# Altium project MiniPC MB GOST.PrjPcb (part 22 of 31)
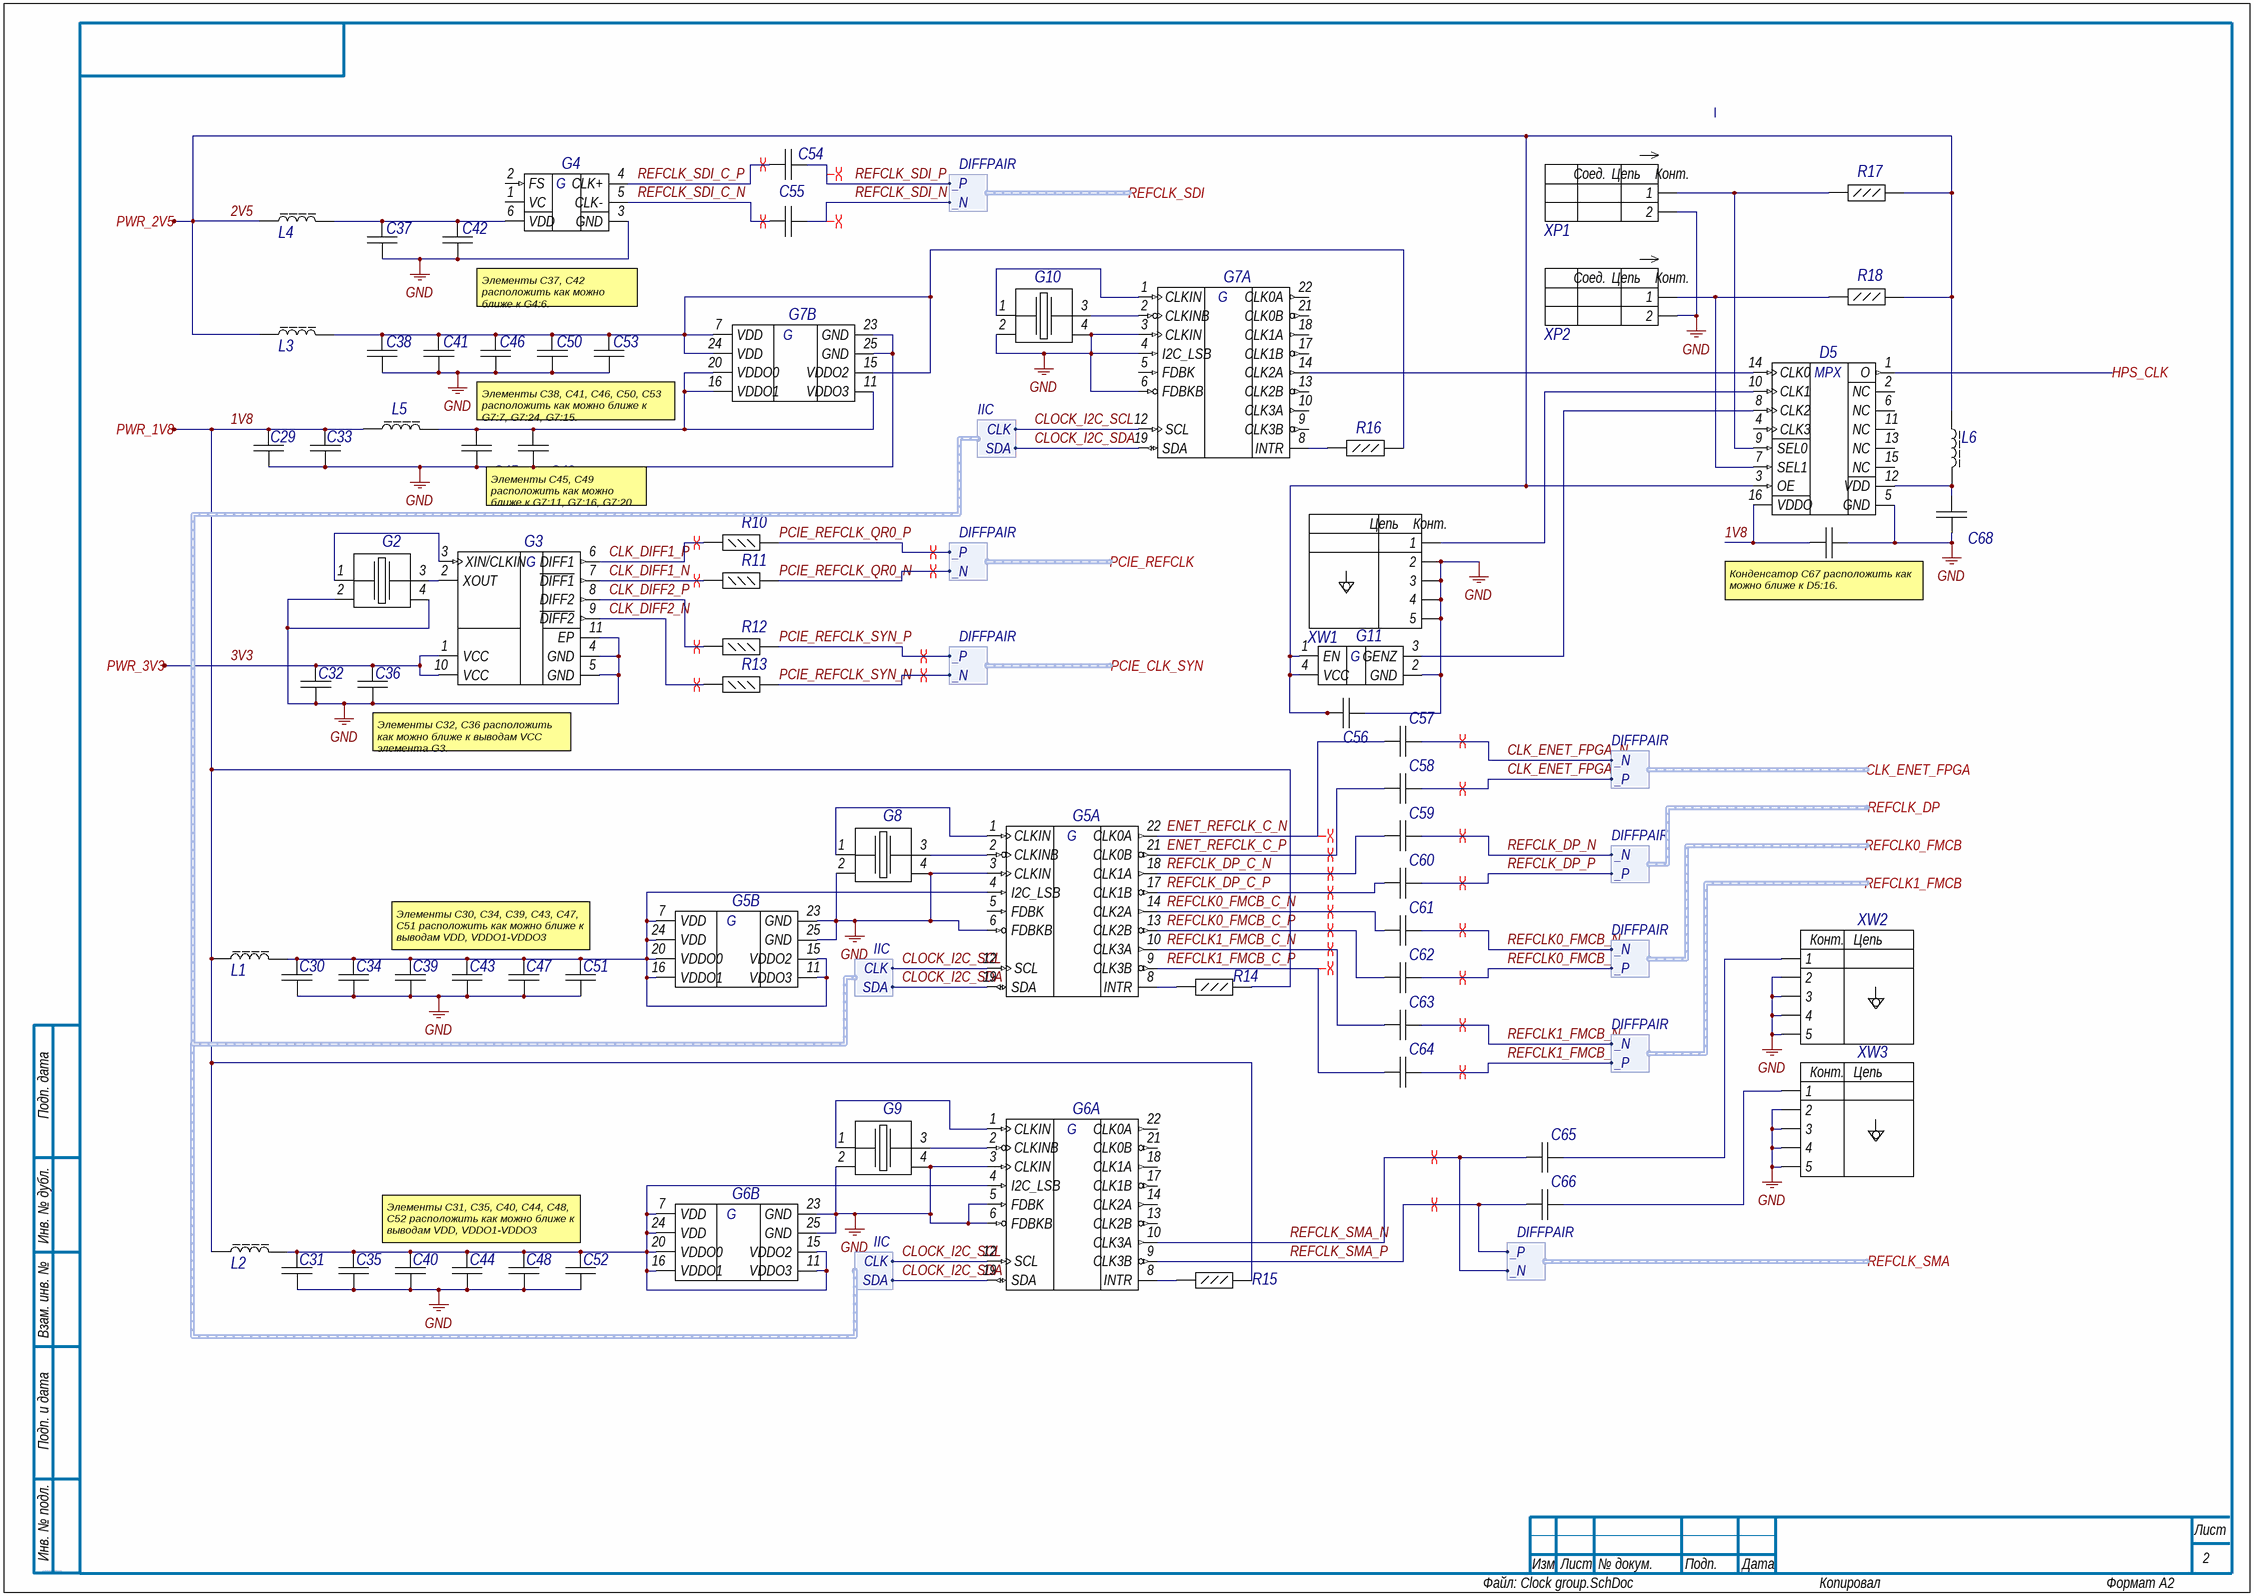
[diagram p50: Clock group.SchDoc]

## Sheet Clock group.SchDoc (continued)

### Library data of the parts (continued)
L5 = E48: SMD EMI Suppression Ferrite Bead WE-CBF, Z = 220 Ohm; Тип элемента: Ферритовый дроссель; Impedance: 220 Ohm; Old_des: L20; New_des: L5; UID: E48; Component Kind: Standard; ComponentLink1Description: Manufacturer Link; ComponentLink1URL: http://www.we-online.com; ComponentLink2Description: Datasheet; ComponentLink2URL: http://www.we-online.de/katalog/media/pdf/742792780.pdf; DatasheetVersion: ver 4, Jul-2009; PackageDescription: Chip Inductor, 2-Leads, Body 1.0 x 0.5 mm; PackageReference: SMD-0402; PackageVersion: 2009
L6 = E48: SMD EMI Suppression Ferrite Bead WE-CBF, Z = 220 Ohm; Тип элемента: Ферритовый дроссель; Impedance: 220 Ohm; Old_des: L21; New_des: L6; UID: E48; Component Kind: Standard; ComponentLink1Description: Manufacturer Link; ComponentLink1URL: http://www.we-online.com; ComponentLink2Description: Datasheet; ComponentLink2URL: http://www.we-online.de/katalog/media/pdf/742792780.pdf; DatasheetVersion: ver 4, Jul-2009; PackageDescription: Chip Inductor, 2-Leads, Body 1.0 x 0.5 mm; PackageReference: SMD-0402; PackageVersion: 2009
R10 = E64: Chip Resistor, 0 mOhm, +/- 5%, 100 mW, -55 to 155 degC, 0402 (1005 Metric), RoHS, Tape and Reel; Manufacturer: Basic Passives; Тип элемента: Резистор; Case\/Package: 0402; Voltage Rating: 50 V; Power Rating: 100 mW; Resistance: 0 mOhm; Old_des: R335; New_des: R10; UID: E64; Component Kind: Standard; Case Code (Imperial): 0402; Case Code (Metric): 1005; ComponentLink1Description: Manufacturer URL; ComponentLink1URL: http://www.panasonic.com/; ComponentLink2Description: Datasheet; ComponentLink2URL: http://industrial.panasonic.com/cdbs/www-data/pdf/RDA0000/AOA0000C84.pdf; DatasheetVersion: 03/2015; Length: 1 mm; Max Operating Temperature: 155 degC; Min Operating Temperature: -55 degC; Mounting Technology: Surface Mount; Package Quantity: 10000; PackageDescription: 2-Pin Surface Mount Device, Body 1 x 0.5 mm; Packaging: Tape and Reel; PartNumber: ERJ-2GE0R00X; RoHSCompliant: true; Tolerance: 5%; Width: 0.5 mm; Height: 0.35 mm; Mount: Surface Mount; PackageReference: 0402; Pins: 2; Radiation Hardening: No; REACH SVHC: Unknown
R11 = E64: Chip Resistor, 0 mOhm, +/- 5%, 100 mW, -55 to 155 degC, 0402 (1005 Metric), RoHS, Tape and Reel; Manufacturer: Basic Passives; Тип элемента: Резистор; Case\/Package: 0402; Voltage Rating: 50 V; Power Rating: 100 mW; Resistance: 0 mOhm; Old_des: R336; New_des: R11; UID: E64; Component Kind: Standard; Case Code (Imperial): 0402; Case Code (Metric): 1005; ComponentLink1Description: Manufacturer URL; ComponentLink1URL: http://www.panasonic.com/; ComponentLink2Description: Datasheet; ComponentLink2URL: http://industrial.panasonic.com/cdbs/www-data/pdf/RDA0000/AOA0000C84.pdf; DatasheetVersion: 03/2015; Length: 1 mm; Max Operating Temperature: 155 degC; Min Operating Temperature: -55 degC; Mounting Technology: Surface Mount; Package Quantity: 10000; PackageDescription: 2-Pin Surface Mount Device, Body 1 x 0.5 mm; Packaging: Tape and Reel; PartNumber: ERJ-2GE0R00X; RoHSCompliant: true; Tolerance: 5%; Width: 0.5 mm; Height: 0.35 mm; Mount: Surface Mount; PackageReference: 0402; Pins: 2; Radiation Hardening: No; REACH SVHC: Unknown
R12 = E64: Chip Resistor, 0 mOhm, +/- 5%, 100 mW, -55 to 155 degC, 0402 (1005 Metric), RoHS, Tape and Reel; Manufacturer: Basic Passives; Тип элемента: Резистор; Case\/Package: 0402; Voltage Rating: 50 V; Power Rating: 100 mW; Resistance: 0 mOhm; Old_des: R337; New_des: R12; UID: E64; Component Kind: Standard; Case Code (Imperial): 0402; Case Code (Metric): 1005; ComponentLink1Description: Manufacturer URL; ComponentLink1URL: http://www.panasonic.com/; ComponentLink2Description: Datasheet; ComponentLink2URL: http://industrial.panasonic.com/cdbs/www-data/pdf/RDA0000/AOA0000C84.pdf; DatasheetVersion: 03/2015; Length: 1 mm; Max Operating Temperature: 155 degC; Min Operating Temperature: -55 degC; Mounting Technology: Surface Mount; Package Quantity: 10000; PackageDescription: 2-Pin Surface Mount Device, Body 1 x 0.5 mm; Packaging: Tape and Reel; PartNumber: ERJ-2GE0R00X; RoHSCompliant: true; Tolerance: 5%; Width: 0.5 mm; Height: 0.35 mm; Mount: Surface Mount; PackageReference: 0402; Pins: 2; Radiation Hardening: No; REACH SVHC: Unknown
R13 = E64: Chip Resistor, 0 mOhm, +/- 5%, 100 mW, -55 to 155 degC, 0402 (1005 Metric), RoHS, Tape and Reel; Manufacturer: Basic Passives; Тип элемента: Резистор; Case\/Package: 0402; Voltage Rating: 50 V; Power Rating: 100 mW; Resistance: 0 mOhm; Old_des: R338; New_des: R13; UID: E64; Component Kind: Standard; Case Code (Imperial): 0402; Case Code (Metric): 1005; ComponentLink1Description: Manufacturer URL; ComponentLink1URL: http://www.panasonic.com/; ComponentLink2Description: Datasheet; ComponentLink2URL: http://industrial.panasonic.com/cdbs/www-data/pdf/RDA0000/AOA0000C84.pdf; DatasheetVersion: 03/2015; Length: 1 mm; Max Operating Temperature: 155 degC; Min Operating Temperature: -55 degC; Mounting Technology: Surface Mount; Package Quantity: 10000; PackageDescription: 2-Pin Surface Mount Device, Body 1 x 0.5 mm; Packaging: Tape and Reel; PartNumber: ERJ-2GE0R00X; RoHSCompliant: true; Tolerance: 5%; Width: 0.5 mm; Height: 0.35 mm; Mount: Surface Mount; PackageReference: 0402; Pins: 2; Radiation Hardening: No; REACH SVHC: Unknown
R14 = E99: Chip Resistor, 4.7 KOhm, +/- 1%, 0.1 W, -55 to 155 degC, 0402 (1005 Metric), RoHS, Tape and Reel; Тип элемента: Резистор; Case\/Package: 0402; Voltage Rating: 50 V; Power Rating: 100 mW; Old_des: R333; New_des: R14; UID: E99; Component Kind: Standard; Case Code (Imperial): 0402; Case Code (Metric): 1005; ComponentLink1Description: Manufacturer URL; ComponentLink1URL: http://www.panasonic.com/; ComponentLink2Description: Datasheet; ComponentLink2URL: http://industrial.panasonic.com/cdbs/www-data/pdf/RDA0000/AOA0000C86.pdf; DatasheetVersion: 04/2015; Length: 1 mm; Max Operating Temperature: 155 degC; Min Operating Temperature: -55 degC; Mounting Technology: Surface Mount; Package Quantity: 1; PackageDescription: 2-Pin Surface Mount Device, Body 1 x 0.5 mm; Packaging: Cut Tape; PartNumber: ERJ-2RKF4701X; RoHSCompliant: true; Tolerance: 1%; Width: 0.5 mm; Height: 0.35 mm; Mount: Surface Mount; PackageReference: 0402; Pins: 2; Radiation Hardening: No; REACH SVHC: Yes; Resistance: 4.7 KOhm
R15 = E99: Chip Resistor, 4.7 KOhm, +/- 1%, 0.1 W, -55 to 155 degC, 0402 (1005 Metric), RoHS, Tape and Reel; Тип элемента: Резистор; Case\/Package: 0402; Voltage Rating: 50 V; Power Rating: 100 mW; Old_des: R334; New_des: R15; UID: E99; Component Kind: Standard; Case Code (Imperial): 0402; Case Code (Metric): 1005; ComponentLink1Description: Manufacturer URL; ComponentLink1URL: http://www.panasonic.com/; ComponentLink2Description: Datasheet; ComponentLink2URL: http://industrial.panasonic.com/cdbs/www-data/pdf/RDA0000/AOA0000C86.pdf; DatasheetVersion: 04/2015; Length: 1 mm; Max Operating Temperature: 155 degC; Min Operating Temperature: -55 degC; Mounting Technology: Surface Mount; Package Quantity: 1; PackageDescription: 2-Pin Surface Mount Device, Body 1 x 0.5 mm; Packaging: Cut Tape; PartNumber: ERJ-2RKF4701X; RoHSCompliant: true; Tolerance: 1%; Width: 0.5 mm; Height: 0.35 mm; Mount: Surface Mount; PackageReference: 0402; Pins: 2; Radiation Hardening: No; REACH SVHC: Yes; Resistance: 4.7 KOhm
R16 = E59: Chip Resistor, 1 KOhm, +/- 1%, 100 mW, -55 to 155 degC, 0402 (1005 Metric), RoHS, Tape and Reel; Manufacturer: Basic Passives; Тип элемента: Резистор; Case\/Package: 0402; Voltage Rating: 50 V; Power Rating: 100 mW; Resistance: 1 KOhm; Old_des: R339; New_des: R16; UID: E59; Component Kind: Standard; Case Code (Imperial): 0402; Case Code (Metric): 1005; ComponentLink1Description: Manufacturer URL; ComponentLink1URL: http://www.panasonic.com/; ComponentLink2Description: Datasheet; ComponentLink2URL: http://industrial.panasonic.com/cdbs/www-data/pdf/RDA0000/AOA0000C86.pdf; DatasheetVersion: 04/2015; Length: 1 mm; Max Operating Temperature: 155 degC; Min Operating Temperature: -55 degC; Mounting Technology: Surface Mount; Package Quantity: 10000; PackageDescription: 2-Pin Surface Mount Device, Body 1 x 0.5 mm; Packaging: Tape and Reel; PartNumber: ERJ-2RKF1001X; RoHSCompliant: true; Tolerance: 1%; Width: 0.5 mm; Height: 0.35 mm; Mount: Surface Mount; PackageReference: 0402; Pins: 2; Radiation Hardening: No; REACH SVHC: Yes
R17 = E59: Chip Resistor, 1 KOhm, +/- 1%, 100 mW, -55 to 155 degC, 0402 (1005 Metric), RoHS, Tape and Reel; Manufacturer: Basic Passives; Тип элемента: Резистор; Case\/Package: 0402; Voltage Rating: 50 V; Power Rating: 100 mW; Resistance: 1 KOhm; Old_des: R340; New_des: R17; UID: E59; Component Kind: Standard; Case Code (Imperial): 0402; Case Code (Metric): 1005; ComponentLink1Description: Manufacturer URL; ComponentLink1URL: http://www.panasonic.com/; ComponentLink2Description: Datasheet; ComponentLink2URL: http://industrial.panasonic.com/cdbs/www-data/pdf/RDA0000/AOA0000C86.pdf; DatasheetVersion: 04/2015; Length: 1 mm; Max Operating Temperature: 155 degC; Min Operating Temperature: -55 degC; Mounting Technology: Surface Mount; Package Quantity: 10000; PackageDescription: 2-Pin Surface Mount Device, Body 1 x 0.5 mm; Packaging: Tape and Reel; PartNumber: ERJ-2RKF1001X; RoHSCompliant: true; Tolerance: 1%; Width: 0.5 mm; Height: 0.35 mm; Mount: Surface Mount; PackageReference: 0402; Pins: 2; Radiation Hardening: No; REACH SVHC: Yes
R18 = E59: Chip Resistor, 1 KOhm, +/- 1%, 100 mW, -55 to 155 degC, 0402 (1005 Metric), RoHS, Tape and Reel; Manufacturer: Basic Passives; Тип элемента: Резистор; Case\/Package: 0402; Voltage Rating: 50 V; Power Rating: 100 mW; Resistance: 1 KOhm; Old_des: R341; New_des: R18; UID: E59; Component Kind: Standard; Case Code (Imperial): 0402; Case Code (Metric): 1005; ComponentLink1Description: Manufacturer URL; ComponentLink1URL: http://www.panasonic.com/; ComponentLink2Description: Datasheet; ComponentLink2URL: http://industrial.panasonic.com/cdbs/www-data/pdf/RDA0000/AOA0000C86.pdf; DatasheetVersion: 04/2015; Length: 1 mm; Max Operating Temperature: 155 degC; Min Operating Temperature: -55 degC; Mounting Technology: Surface Mount; Package Quantity: 10000; PackageDescription: 2-Pin Surface Mount Device, Body 1 x 0.5 mm; Packaging: Tape and Reel; PartNumber: ERJ-2RKF1001X; RoHSCompliant: true; Tolerance: 1%; Width: 0.5 mm; Height: 0.35 mm; Mount: Surface Mount; PackageReference: 0402; Pins: 2; Radiation Hardening: No; REACH SVHC: Yes
XP1 = E32: Male Header, Pitch 2.54 mm, 1 x 2 Position, Height 8.54 mm, Tail Length 3 mm, -40 to 105 degC, RoHS, Bulk; Manufacturer: Wuerth Elektronik; Тип элемента: Соединитель; Old_des: J18; New_des: XP1; UID: E32; Component Kind: Standard; ComponentLink1Description: Manufacturer URL; ComponentLink1URL: https://www.we-online.com/; ComponentLink2Description: Datasheet; ComponentLink2URL: http://katalog.we-online.de/em/datasheet/6130xx11121.pdf; DatasheetVersion: Rev. J; Mounting Technology: Through Hole; PackageDescription: Male Header, Pitch 2.54 mm, 1 x 2 Position, Height 8.54 mm, Tail Length 3 mm; PartNumber: 613 002 111 21; PackageReference: 61300211121
XP2 = E32: Male Header, Pitch 2.54 mm, 1 x 2 Position, Height 8.54 mm, Tail Length 3 mm, -40 to 105 degC, RoHS, Bulk; Manufacturer: Wuerth Elektronik; Тип элемента: Соединитель; Old_des: J19; New_des: XP2; UID: E32; Component Kind: Standard; ComponentLink1Description: Manufacturer URL; ComponentLink1URL: https://www.we-online.com/; ComponentLink2Description: Datasheet; ComponentLink2URL: http://katalog.we-online.de/em/datasheet/6130xx11121.pdf; DatasheetVersion: Rev. J; Mounting Technology: Through Hole; PackageDescription: Male Header, Pitch 2.54 mm, 1 x 2 Position, Height 8.54 mm, Tail Length 3 mm; PartNumber: 613 002 111 21; PackageReference: 61300211121
XW1 = E42: SMA Connector, Pitch 2.54 mm, 1 Position, Height 9.5 mm, Tail Length 4 mm, RoHS; Manufacturer: Lighthorse Technologies Inc.; Тип элемента: Соединитель ВЧ; Old_des: J17; New_des: XW1; UID: E42; Component Kind: Standard; ComponentLink1Description: Manufacturer URL; ComponentLink1URL: http://www.rfconnector.com; ComponentLink2Description: Datasheet; ComponentLink2URL: http://rfconnector.com/sheets/SASF54GT.pdf; DatasheetVersion: Rev. May-99; Mounting Technology: Through Hole; PackageDescription: SMA Connector, Pitch 2.54 mm, 1 Position, Height 9.5 mm, Tail Length 4 mm; PartNumber: LTI-SASF54GT; PackageReference: LTI-SASF54GT
XW2 = E42: SMA Connector, Pitch 2.54 mm, 1 Position, Height 9.5 mm, Tail Length 4 mm, RoHS; Manufacturer: Lighthorse Technologies Inc.; Тип элемента: Соединитель ВЧ; Old_des: J15; New_des: XW2; UID: E42; Component Kind: Standard; ComponentLink1Description: Manufacturer URL; ComponentLink1URL: http://www.rfconnector.com; ComponentLink2Description: Datasheet; ComponentLink2URL: http://rfconnector.com/sheets/SASF54GT.pdf; DatasheetVersion: Rev. May-99; Mounting Technology: Through Hole; PackageDescription: SMA Connector, Pitch 2.54 mm, 1 Position, Height 9.5 mm, Tail Length 4 mm; PartNumber: LTI-SASF54GT; PackageReference: LTI-SASF54GT
XW3 = E42: SMA Connector, Pitch 2.54 mm, 1 Position, Height 9.5 mm, Tail Length 4 mm, RoHS; Manufacturer: Lighthorse Technologies Inc.; Тип элемента: Соединитель ВЧ; Old_des: J16; New_des: XW3; UID: E42; Component Kind: Standard; ComponentLink1Description: Manufacturer URL; ComponentLink1URL: http://www.rfconnector.com; ComponentLink2Description: Datasheet; ComponentLink2URL: http://rfconnector.com/sheets/SASF54GT.pdf; DatasheetVersion: Rev. May-99; Mounting Technology: Through Hole; PackageDescription: SMA Connector, Pitch 2.54 mm, 1 Position, Height 9.5 mm, Tail Length 4 mm; PartNumber: LTI-SASF54GT; PackageReference: LTI-SASF54GT

## Sheet Display Port Interface.SchDoc
size 420 x 297 mm; Author: ALTIUM GOSTBOM2.0 KEV; SheetNumber: 3; SheetTotal: 48
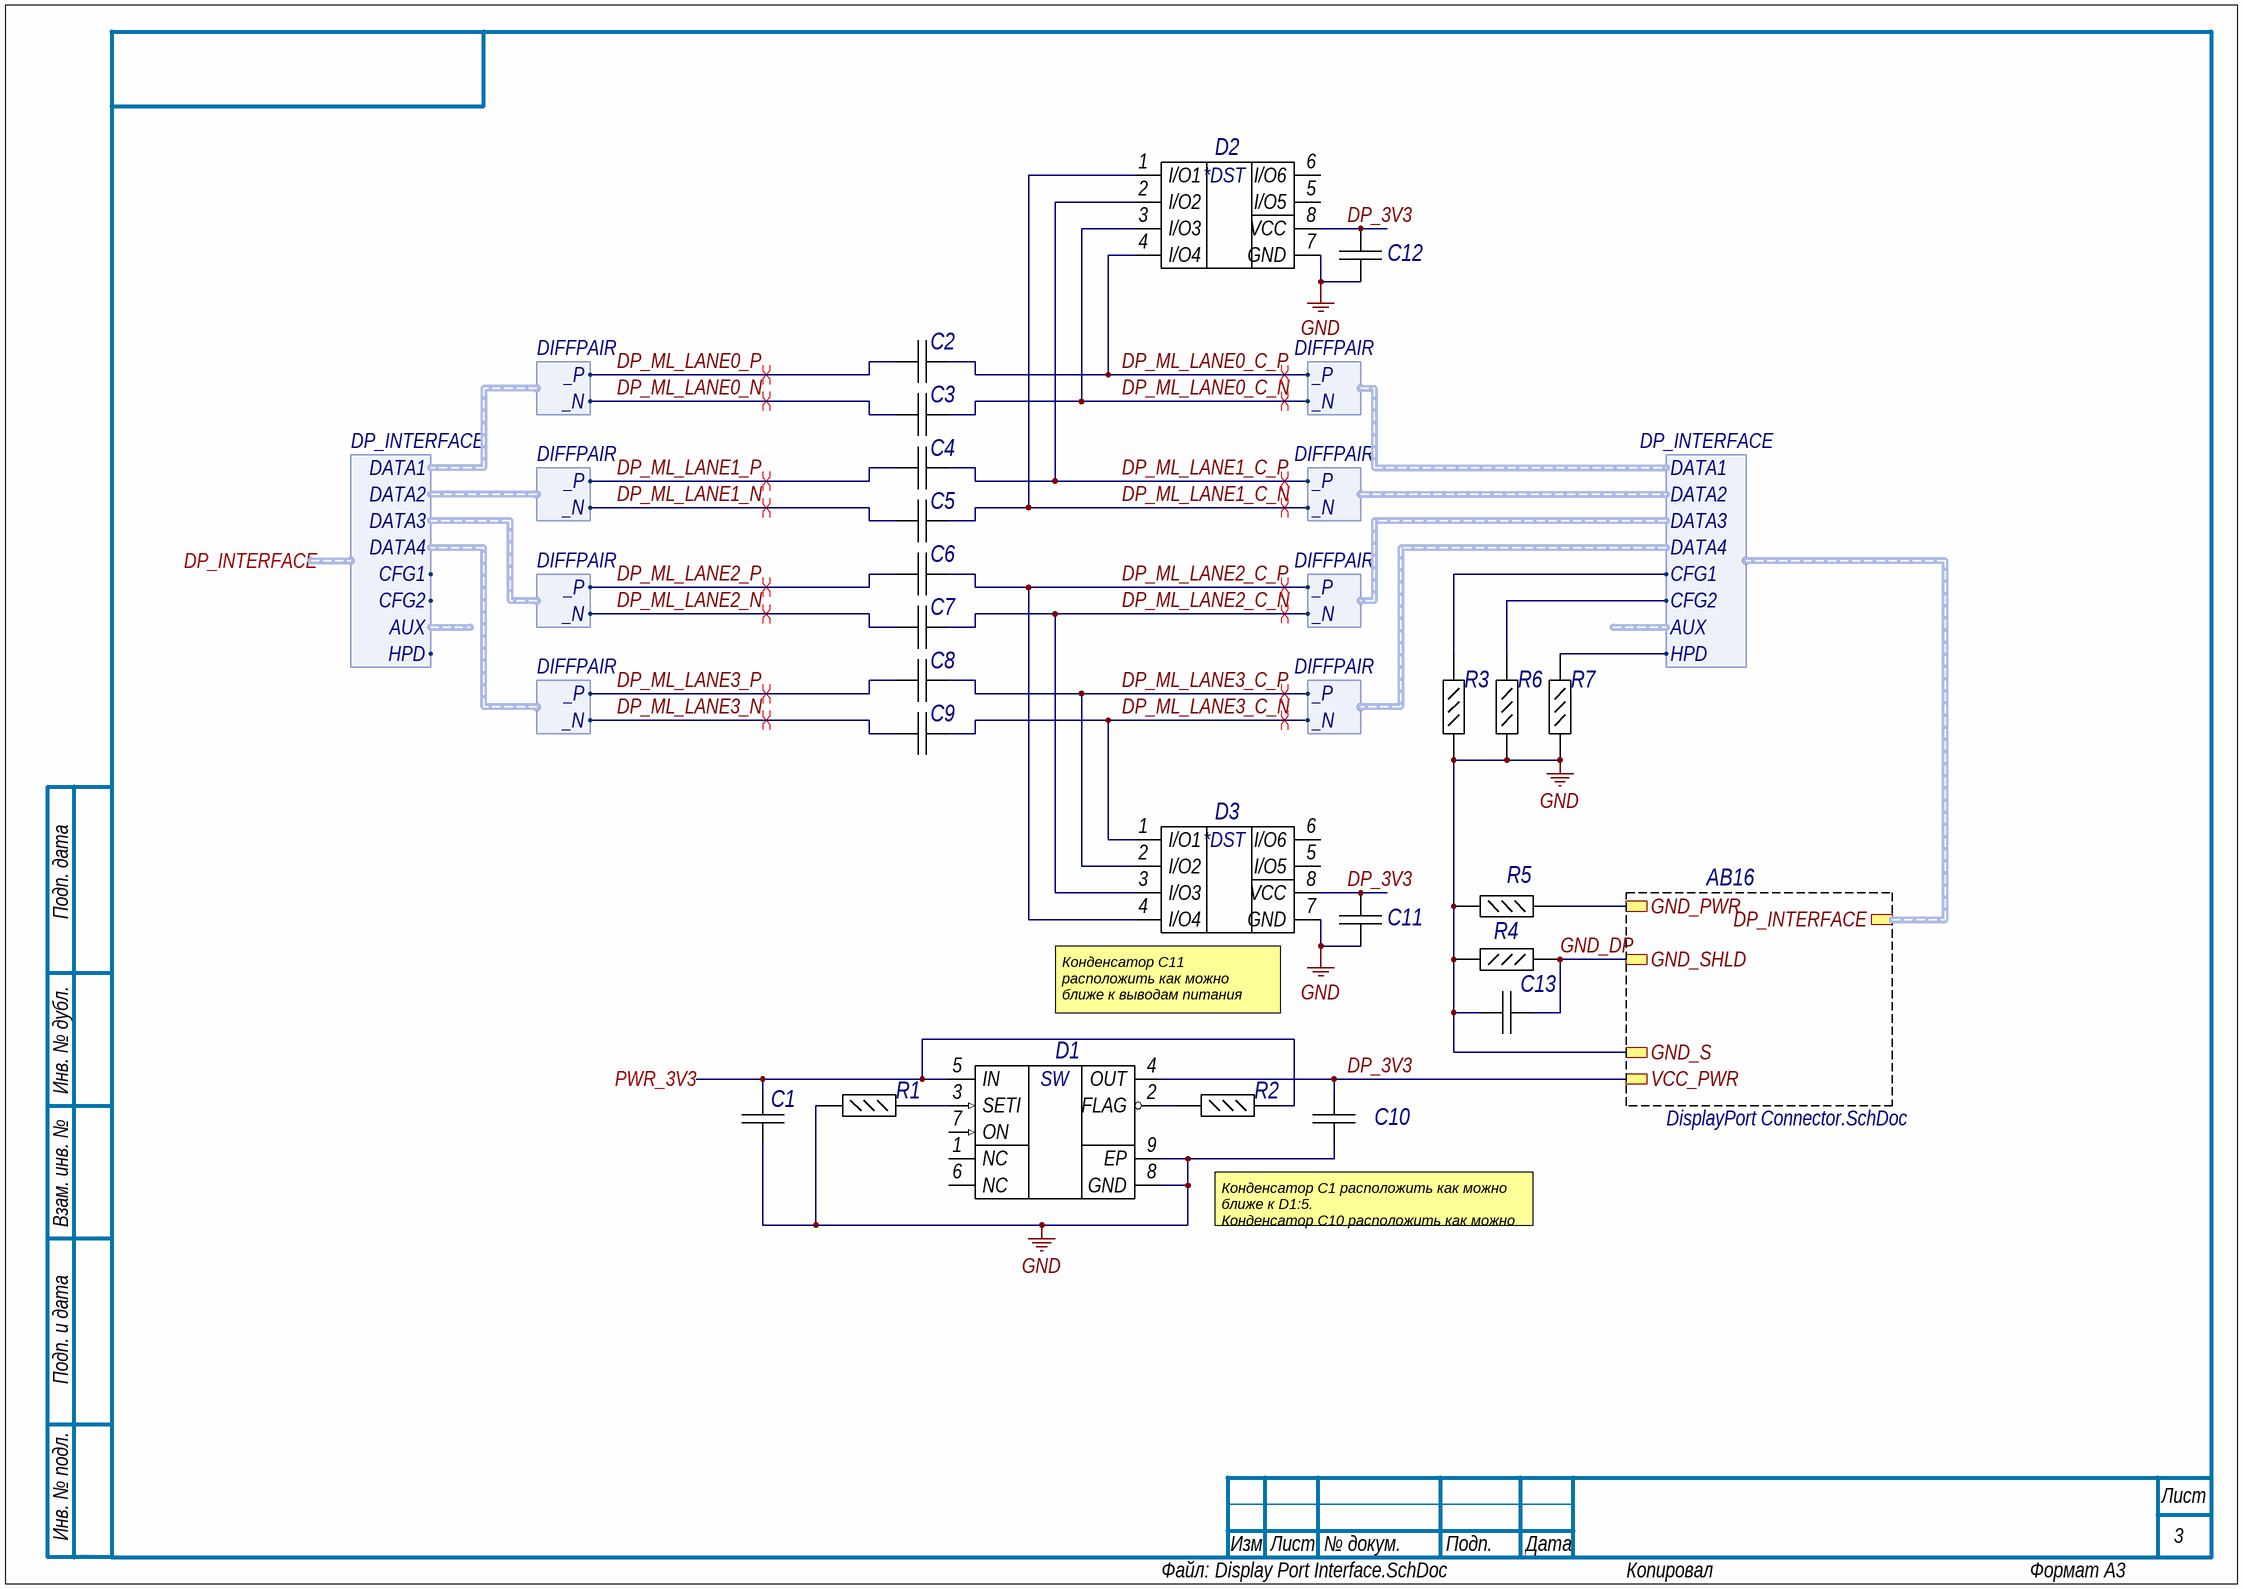
[diagram p29: Display Port Interface.SchDoc]

### Parts
C1  GRM188R61A225KE34x  [CAPC1608X90X35ML10T15]  (value not drawn)
C2  C1005X7R1E104M  [CAPC1005X55X10LL05]  (value not drawn)
C3  C1005X7R1E104M  [CAPC1005X55X10LL05]  (value not drawn)
C4  C1005X7R1E104M  [CAPC1005X55X10LL05]  (value not drawn)
C5  C1005X7R1E104M  [CAPC1005X55X10LL05]  (value not drawn)
C6  C1005X7R1E104M  [CAPC1005X55X10LL05]  (value not drawn)
C7  C1005X7R1E104M  [CAPC1005X55X10LL05]  (value not drawn)
C8  C1005X7R1E104M  [CAPC1005X55X10LL05]  (value not drawn)
C9  C1005X7R1E104M  [CAPC1005X55X10LL05]  (value not drawn)
C10  C1005X7R1E104M  [CAPC1005X55X10LL05]  (value not drawn)
C11  C1005X7R1E104M  [CAPC1005X55X10LL05]  (value not drawn)
C12  C1005X7R1E104M  [CAPC1005X55X10LL05]  (value not drawn)
C13  GRM155R71H472KA01D  [CAPC1005X55X25NL05T10]  (value not drawn)
D1  MAX14523AATA+  [MAXM-T833+2_V]  (value not drawn)
D2  82401646  [MSOP-8L]  (value not drawn)
D3  82401646  [MSOP-8L]  (value not drawn)
R1  ERJ-2RKF2803X  [RESC1005X40X25LL05T05]  (value not drawn)
R2  ERJ-2RKF1003X  [RESC1005X40X25LL05T05]  (value not drawn)
R3  ERJ-2RKF1004X  [RESC1005X40X25LL05T05]  (value not drawn)
R4  ERJ-2RKF1004X  [RESC1005X40X25LL05T05]  (value not drawn)
R5  ERJ-2GE0R00X  [RESC1005X40X25LL05T05]  (value not drawn)
R6  ERJ-2RKF1004X  [RESC1005X40X25LL05T05]  (value not drawn)
R7  ERJ-2RKF1003X  [RESC1005X40X25LL05T05]  (value not drawn)

### Sub-sheets
AB16 = DisplayPort Connector.SchDoc: GND_SHLD, GND_S, VCC_PWR, GND_PWR, DP_INTERFACE (harness DP_INTERFACE)

### Ports
DP_INTERFACE (harness DP_INTERFACE), PWR_3V3

### Harnesses
DP_INTERFACE: DATA1, DATA2, DATA3, DATA4, CFG1, CFG2, AUX, HPD
DIFFPAIR: _P, _N

### Nets
GND: C1.2 C10.1 C11.1 C12.1 C13.1 D1.8(GND) D1.9(EP) D2.7(GND) D3.7(GND) R1.2 R3.1 R4.1 R5.1 R6.1 R7.1 ; sheet AB16/GND_S
DP_3V3: C10.2 C11.2 C12.2 D1.4(OUT) D2.8(VCC) D3.8(VCC) ; sheet AB16/VCC_PWR
DP_ML_LANE0_C_N: C3.2 D2.3(I/O3) ; harness DIFFPAIR._N
DP_ML_LANE0_C_P: C2.2 D2.4(I/O4) ; harness DIFFPAIR._P
DP_ML_LANE0_N: C3.1 ; harness DIFFPAIR._N
DP_ML_LANE0_P: C2.1 ; harness DIFFPAIR._P
DP_ML_LANE1_C_N: C5.2 D2.1(I/O1) ; harness DIFFPAIR._N
DP_ML_LANE1_C_P: C4.2 D2.2(I/O2) ; harness DIFFPAIR._P
DP_ML_LANE1_N: C5.1 ; harness DIFFPAIR._N
DP_ML_LANE1_P: C4.1 ; harness DIFFPAIR._P
DP_ML_LANE2_C_N: C7.2 D3.3(I/O3) ; harness DIFFPAIR._N
DP_ML_LANE2_C_P: C6.2 D3.4(I/O4) ; harness DIFFPAIR._P
DP_ML_LANE2_N: C7.1 ; harness DIFFPAIR._N
DP_ML_LANE2_P: C6.1 ; harness DIFFPAIR._P
DP_ML_LANE3_C_N: C9.2 D3.1(I/O1) ; harness DIFFPAIR._N
DP_ML_LANE3_C_P: C8.2 D3.2(I/O2) ; harness DIFFPAIR._P
DP_ML_LANE3_N: C9.1 ; harness DIFFPAIR._N
DP_ML_LANE3_P: C8.1 ; harness DIFFPAIR._P
GND_DP: C13.2 R4.2 ; sheet AB16/GND_SHLD
IO_3V3: C1.1 D1.5(IN) R2.2 ; port PWR_3V3
NetD1_2: D1.2(FLAG) R2.1
NetD1_3: D1.3(SETI) R1.1
NetR3_2: R3.2 ; sheet AB16/DP_INTERFACE.CFG1
NetR5_2: R5.2 ; sheet AB16/GND_PWR
NetR6_2: R6.2 ; sheet AB16/DP_INTERFACE.CFG2
NetR7_2: R7.2 ; sheet AB16/DP_INTERFACE.HPD

Not connected (* = marked no-connect by the designer): D1 1(NC) 6(NC) 7(ON); D2 5(I/O5) 6(I/O6); D3 5(I/O5) 6(I/O6)

### Layout directives
differential pair: DP_ML_LANE0_C_N, DP_ML_LANE0_C_P, DP_ML_LANE0_N, DP_ML_LANE0_P, DP_ML_LANE1_C_N, DP_ML_LANE1_C_P, DP_ML_LANE1_N, DP_ML_LANE1_P, DP_ML_LANE2_C_N, DP_ML_LANE2_C_P, DP_ML_LANE2_N, DP_ML_LANE2_P, DP_ML_LANE3_C_N, DP_ML_LANE3_C_P, DP_ML_LANE3_N, DP_ML_LANE3_P

### Notes on the sheet
- (near D3) Конденсатор C11 расположить как можно ближе к выводам питания микросхемы D3.
- Конденсатор C1 расположить как можно ближе к D1:5.
  Конденсатор C10 расположить как можно ближе к D1:4.
- Подп. дата
- Инв. № дубл.
- Взам. инв. №
- Подп. и дата
- Инв. № подл.
- Изм.
- Лист
- № докум.
- Подп.
- Дата
- ALTIUM GOSTBOM2.0 KEV
- Файл:
- Копировал
- Формат А3
- (in symbol E29) *DST
- (in symbol E115) SW

### Library data of the parts
C1 = E23: Chip Capacitor, 2.2 uF, +/- 10%, 10 V, -55 to 85 degC, 0603 (1608 Metric), RoHS, Tape and Reel; Тип элемента: Конденсатор; Capacitance: 2.2 uF; Old_des: C297; New_des: C1; UID: E23; Component Kind: Standard; Case Code (Imperial): 0603; Case Code (Metric): 1608; Case/Package: 0603; ComponentLink1Description: Manufacturer URL; ComponentLink1URL: http://www.murata.com/; ComponentLink2Description: Datasheet; ComponentLink2URL: https://datasheet.ciiva.com/134/grm188r61a225ke34-01-134206.pdf; DatasheetVersion: 01/2013; Length: 0.063 inch; Max Operating Temperature: 85 degC; Min Operating Temperature: -55 degC; Mounting Technology: Surface Mount; Package Quantity: 10000; PackageDescription: 2-Pin Surface Mount Device, Body 1.6 x 0.8 mm; Packaging: Tape and Reel; PartNumber: GRM188R61A225KE34x; RoHSCompliant: True; Tolerance: 10%; Width: 0.031 inch; Height: 0.8 mm; Radiation Hardening: No
C2 = E11: Chip Capacitor, 0.1 uF, +/- 20%, 25 V, -55 to 125 degC, 0402 (1005 Metric), RoHS, Tape and Reel; Тип элемента: Конденсатор; Capacitance: 100 nF; Case\/Package: 0402; Type (Capacitors): X7R; Voltage Rating: 25 V; Old_des: C309; New_des: C2; UID: E11; Component Kind: Standard; Case Code (Imperial): 0402; Case Code (Metric): 1005; ComponentLink1Description: Manufacturer URL; ComponentLink1URL: http://www.tdk.com/; ComponentLink2Description: Datasheet; ComponentLink2URL: http://www.farnell.com/datasheets/1571323.pdf; DatasheetVersion: 09/2011; Length: 1 mm; Max Operating Temperature: 125 degC; Min Operating Temperature: -55 degC; Mounting Technology: Surface Mount; Package Quantity: 10000; PackageDescription: 2-Pin Surface Mount Device, Body 1 x 0.5 mm; Packaging: Tape and Reel; PartNumber: C1005X7R1E104M; RoHSCompliant: true; Tolerance: 20%; Width: 0.5 mm; Height: 0.5 mm; Mount: Surface Mount; PackageReference: 0402; Pins: 2; Voltage Rating (DC): 25 V
C3 = E11: Chip Capacitor, 0.1 uF, +/- 20%, 25 V, -55 to 125 degC, 0402 (1005 Metric), RoHS, Tape and Reel; Тип элемента: Конденсатор; Capacitance: 100 nF; Case\/Package: 0402; Type (Capacitors): X7R; Voltage Rating: 25 V; Old_des: C307; New_des: C3; UID: E11; Component Kind: Standard; Case Code (Imperial): 0402; Case Code (Metric): 1005; ComponentLink1Description: Manufacturer URL; ComponentLink1URL: http://www.tdk.com/; ComponentLink2Description: Datasheet; ComponentLink2URL: http://www.farnell.com/datasheets/1571323.pdf; DatasheetVersion: 09/2011; Length: 1 mm; Max Operating Temperature: 125 degC; Min Operating Temperature: -55 degC; Mounting Technology: Surface Mount; Package Quantity: 10000; PackageDescription: 2-Pin Surface Mount Device, Body 1 x 0.5 mm; Packaging: Tape and Reel; PartNumber: C1005X7R1E104M; RoHSCompliant: true; Tolerance: 20%; Width: 0.5 mm; Height: 0.5 mm; Mount: Surface Mount; PackageReference: 0402; Pins: 2; Voltage Rating (DC): 25 V
C4 = E11: Chip Capacitor, 0.1 uF, +/- 20%, 25 V, -55 to 125 degC, 0402 (1005 Metric), RoHS, Tape and Reel; Тип элемента: Конденсатор; Capacitance: 100 nF; Case\/Package: 0402; Type (Capacitors): X7R; Voltage Rating: 25 V; Old_des: C306; New_des: C4; UID: E11; Component Kind: Standard; Case Code (Imperial): 0402; Case Code (Metric): 1005; ComponentLink1Description: Manufacturer URL; ComponentLink1URL: http://www.tdk.com/; ComponentLink2Description: Datasheet; ComponentLink2URL: http://www.farnell.com/datasheets/1571323.pdf; DatasheetVersion: 09/2011; Length: 1 mm; Max Operating Temperature: 125 degC; Min Operating Temperature: -55 degC; Mounting Technology: Surface Mount; Package Quantity: 10000; PackageDescription: 2-Pin Surface Mount Device, Body 1 x 0.5 mm; Packaging: Tape and Reel; PartNumber: C1005X7R1E104M; RoHSCompliant: true; Tolerance: 20%; Width: 0.5 mm; Height: 0.5 mm; Mount: Surface Mount; PackageReference: 0402; Pins: 2; Voltage Rating (DC): 25 V
C5 = E11: Chip Capacitor, 0.1 uF, +/- 20%, 25 V, -55 to 125 degC, 0402 (1005 Metric), RoHS, Tape and Reel; Тип элемента: Конденсатор; Capacitance: 100 nF; Case\/Package: 0402; Type (Capacitors): X7R; Voltage Rating: 25 V; Old_des: C305; New_des: C5; UID: E11; Component Kind: Standard; Case Code (Imperial): 0402; Case Code (Metric): 1005; ComponentLink1Description: Manufacturer URL; ComponentLink1URL: http://www.tdk.com/; ComponentLink2Description: Datasheet; ComponentLink2URL: http://www.farnell.com/datasheets/1571323.pdf; DatasheetVersion: 09/2011; Length: 1 mm; Max Operating Temperature: 125 degC; Min Operating Temperature: -55 degC; Mounting Technology: Surface Mount; Package Quantity: 10000; PackageDescription: 2-Pin Surface Mount Device, Body 1 x 0.5 mm; Packaging: Tape and Reel; PartNumber: C1005X7R1E104M; RoHSCompliant: true; Tolerance: 20%; Width: 0.5 mm; Height: 0.5 mm; Mount: Surface Mount; PackageReference: 0402; Pins: 2; Voltage Rating (DC): 25 V
C6 = E11: Chip Capacitor, 0.1 uF, +/- 20%, 25 V, -55 to 125 degC, 0402 (1005 Metric), RoHS, Tape and Reel; Тип элемента: Конденсатор; Capacitance: 100 nF; Case\/Package: 0402; Type (Capacitors): X7R; Voltage Rating: 25 V; Old_des: C304; New_des: C6; UID: E11; Component Kind: Standard; Case Code (Imperial): 0402; Case Code (Metric): 1005; ComponentLink1Description: Manufacturer URL; ComponentLink1URL: http://www.tdk.com/; ComponentLink2Description: Datasheet; ComponentLink2URL: http://www.farnell.com/datasheets/1571323.pdf; DatasheetVersion: 09/2011; Length: 1 mm; Max Operating Temperature: 125 degC; Min Operating Temperature: -55 degC; Mounting Technology: Surface Mount; Package Quantity: 10000; PackageDescription: 2-Pin Surface Mount Device, Body 1 x 0.5 mm; Packaging: Tape and Reel; PartNumber: C1005X7R1E104M; RoHSCompliant: true; Tolerance: 20%; Width: 0.5 mm; Height: 0.5 mm; Mount: Surface Mount; PackageReference: 0402; Pins: 2; Voltage Rating (DC): 25 V
C7 = E11: Chip Capacitor, 0.1 uF, +/- 20%, 25 V, -55 to 125 degC, 0402 (1005 Metric), RoHS, Tape and Reel; Тип элемента: Конденсатор; Capacitance: 100 nF; Case\/Package: 0402; Type (Capacitors): X7R; Voltage Rating: 25 V; Old_des: C303; New_des: C7; UID: E11; Component Kind: Standard; Case Code (Imperial): 0402; Case Code (Metric): 1005; ComponentLink1Description: Manufacturer URL; ComponentLink1URL: http://www.tdk.com/; ComponentLink2Description: Datasheet; ComponentLink2URL: http://www.farnell.com/datasheets/1571323.pdf; DatasheetVersion: 09/2011; Length: 1 mm; Max Operating Temperature: 125 degC; Min Operating Temperature: -55 degC; Mounting Technology: Surface Mount; Package Quantity: 10000; PackageDescription: 2-Pin Surface Mount Device, Body 1 x 0.5 mm; Packaging: Tape and Reel; PartNumber: C1005X7R1E104M; RoHSCompliant: true; Tolerance: 20%; Width: 0.5 mm; Height: 0.5 mm; Mount: Surface Mount; PackageReference: 0402; Pins: 2; Voltage Rating (DC): 25 V
C8 = E11: Chip Capacitor, 0.1 uF, +/- 20%, 25 V, -55 to 125 degC, 0402 (1005 Metric), RoHS, Tape and Reel; Тип элемента: Конденсатор; Capacitance: 100 nF; Case\/Package: 0402; Type (Capacitors): X7R; Voltage Rating: 25 V; Old_des: C302; New_des: C8; UID: E11; Component Kind: Standard; Case Code (Imperial): 0402; Case Code (Metric): 1005; ComponentLink1Description: Manufacturer URL; ComponentLink1URL: http://www.tdk.com/; ComponentLink2Description: Datasheet; ComponentLink2URL: http://www.farnell.com/datasheets/1571323.pdf; DatasheetVersion: 09/2011; Length: 1 mm; Max Operating Temperature: 125 degC; Min Operating Temperature: -55 degC; Mounting Technology: Surface Mount; Package Quantity: 10000; PackageDescription: 2-Pin Surface Mount Device, Body 1 x 0.5 mm; Packaging: Tape and Reel; PartNumber: C1005X7R1E104M; RoHSCompliant: true; Tolerance: 20%; Width: 0.5 mm; Height: 0.5 mm; Mount: Surface Mount; PackageReference: 0402; Pins: 2; Voltage Rating (DC): 25 V
C9 = E11: Chip Capacitor, 0.1 uF, +/- 20%, 25 V, -55 to 125 degC, 0402 (1005 Metric), RoHS, Tape and Reel; Тип элемента: Конденсатор; Capacitance: 100 nF; Case\/Package: 0402; Type (Capacitors): X7R; Voltage Rating: 25 V; Old_des: C301; New_des: C9; UID: E11; Component Kind: Standard; Case Code (Imperial): 0402; Case Code (Metric): 1005; ComponentLink1Description: Manufacturer URL; ComponentLink1URL: http://www.tdk.com/; ComponentLink2Description: Datasheet; ComponentLink2URL: http://www.farnell.com/datasheets/1571323.pdf; DatasheetVersion: 09/2011; Length: 1 mm; Max Operating Temperature: 125 degC; Min Operating Temperature: -55 degC; Mounting Technology: Surface Mount; Package Quantity: 10000; PackageDescription: 2-Pin Surface Mount Device, Body 1 x 0.5 mm; Packaging: Tape and Reel; PartNumber: C1005X7R1E104M; RoHSCompliant: true; Tolerance: 20%; Width: 0.5 mm; Height: 0.5 mm; Mount: Surface Mount; PackageReference: 0402; Pins: 2; Voltage Rating (DC): 25 V
C10 = E11: Chip Capacitor, 0.1 uF, +/- 20%, 25 V, -55 to 125 degC, 0402 (1005 Metric), RoHS, Tape and Reel; Тип элемента: Конденсатор; Capacitance: 100 nF; Case\/Package: 0402; Type (Capacitors): X7R; Voltage Rating: 25 V; Old_des: C298; New_des: C10; UID: E11; Component Kind: Standard; Case Code (Imperial): 0402; Case Code (Metric): 1005; ComponentLink1Description: Manufacturer URL; ComponentLink1URL: http://www.tdk.com/; ComponentLink2Description: Datasheet; ComponentLink2URL: http://www.farnell.com/datasheets/1571323.pdf; DatasheetVersion: 09/2011; Length: 1 mm; Max Operating Temperature: 125 degC; Min Operating Temperature: -55 degC; Mounting Technology: Surface Mount; Package Quantity: 10000; PackageDescription: 2-Pin Surface Mount Device, Body 1 x 0.5 mm; Packaging: Tape and Reel; PartNumber: C1005X7R1E104M; RoHSCompliant: true; Tolerance: 20%; Width: 0.5 mm; Height: 0.5 mm; Mount: Surface Mount; PackageReference: 0402; Pins: 2; Voltage Rating (DC): 25 V
C11 = E11: Chip Capacitor, 0.1 uF, +/- 20%, 25 V, -55 to 125 degC, 0402 (1005 Metric), RoHS, Tape and Reel; Тип элемента: Конденсатор; Capacitance: 100 nF; Case\/Package: 0402; Type (Capacitors): X7R; Voltage Rating: 25 V; Old_des: C300; New_des: C12; UID: E11; Component Kind: Standard; Case Code (Imperial): 0402; Case Code (Metric): 1005; ComponentLink1Description: Manufacturer URL; ComponentLink1URL: http://www.tdk.com/; ComponentLink2Description: Datasheet; ComponentLink2URL: http://www.farnell.com/datasheets/1571323.pdf; DatasheetVersion: 09/2011; Length: 1 mm; Max Operating Temperature: 125 degC; Min Operating Temperature: -55 degC; Mounting Technology: Surface Mount; Package Quantity: 10000; PackageDescription: 2-Pin Surface Mount Device, Body 1 x 0.5 mm; Packaging: Tape and Reel; PartNumber: C1005X7R1E104M; RoHSCompliant: true; Tolerance: 20%; Width: 0.5 mm; Height: 0.5 mm; Mount: Surface Mount; PackageReference: 0402; Pins: 2; Voltage Rating (DC): 25 V
C12 = E11: Chip Capacitor, 0.1 uF, +/- 20%, 25 V, -55 to 125 degC, 0402 (1005 Metric), RoHS, Tape and Reel; Тип элемента: Конденсатор; Capacitance: 100 nF; Case\/Package: 0402; Type (Capacitors): X7R; Voltage Rating: 25 V; Old_des: C299; New_des: C11; UID: E11; Component Kind: Standard; Case Code (Imperial): 0402; Case Code (Metric): 1005; ComponentLink1Description: Manufacturer URL; ComponentLink1URL: http://www.tdk.com/; ComponentLink2Description: Datasheet; ComponentLink2URL: http://www.farnell.com/datasheets/1571323.pdf; DatasheetVersion: 09/2011; Length: 1 mm; Max Operating Temperature: 125 degC; Min Operating Temperature: -55 degC; Mounting Technology: Surface Mount; Package Quantity: 10000; PackageDescription: 2-Pin Surface Mount Device, Body 1 x 0.5 mm; Packaging: Tape and Reel; PartNumber: C1005X7R1E104M; RoHSCompliant: true; Tolerance: 20%; Width: 0.5 mm; Height: 0.5 mm; Mount: Surface Mount; PackageReference: 0402; Pins: 2; Voltage Rating (DC): 25 V
C13 = E24: Chip Capacitor, 4.7 nF, +/- 10%, 50 V, -55 to 125 degC, 0402 (1005 Metric), RoHS, Tape and Reel; Manufacturer: Basic Passives; Тип элемента: Конденсатор; Capacitance: 4.7 nF; Case\/Package: 0402; Type (Capacitors): X7R; Voltage Rating: 50 V; Old_des: C308; New_des: C13; UID: E24; Component Kind: Standard; Case Code (Imperial): 0402; Case Code (Metric): 1005; ComponentLink1Description: Manufacturer URL; ComponentLink1URL: http://www.murata.com/; ComponentLink2Description: Datasheet; ComponentLink2URL: http://search.murata.co.jp/Ceramy/image/img/A01X/G101/ENG/GRM155R71H472KA01-01.pdf; DatasheetVersion: 02/2016; Length: 1 mm; Max Operating Temperature: 125 degC; Min Operating Temperature: -55 degC; Mounting Technology: Surface Mount; Package Quantity: 1; PackageDescription: 2-Pin Surface Mount Device, Body 1 x 0.5 mm; Packaging: Cut Tape; PartNumber: GRM155R71H472KA01D; RoHSCompliant: true; Tolerance: 10%; Width: 0.5 mm; Height: 0.5 mm; Lead Pitch: 2 mm; Mount: Surface Mount; PackageReference: 0402; Pins: 2; Radiation Hardening: No; REACH SVHC: No SVHC; Voltage Rating (DC): 50 V
D1 = E115: Adjustable Current-Limit Switch, 1.7 to 5.5 V, -40 to 125 degC, 8-Pin TDFN (T833+2), RoHS; Manufacturer: Maxim; Тип элемента: Электронный ключ; ILIM: 0.25 to 1.5 A; IQ: 170 uA Typ.; RON: 70 mOhm Typ.; VIH: 1.6 V Min.; VIL: 0.4 V Max.; Old_des: U16; New_des: D1; UID: E115; Component Kind: Standard; ComponentLink1Description: Manufacturer URL; ComponentLink1URL: http://www.maximintegrated.com/; ComponentLink2Description: Datasheet; ComponentLink2URL: http://datasheets.maximintegrated.com/en/ds/MAX14523A-MAX14523C.pdf; DatasheetVersion: Rev. 1; Mounting Technology: Surface Mount; PackageDescription: 8-Pin SON, Body 3 x 3 mm, Pitch 0.65 mm; PartNumber: MAX14523AATA+; ComponentLink3Description: Package Specification; ComponentLink3URL: http://pdfserv.maximintegrated.com/package_dwgs/21-0137.PDF; PackageVersion: Mar-14; RoHS: TRUE; Operating Temperature: -40 to 125 degC; VIN: 1.7 to 5.5 V
D2 = E29: TVS Diode WE-TVS-SS, VRWM=5V; Manufacturer: Wuerth Elektronik; Тип элемента: Сборка диодная; Reverse Stand Off Voltage: 5V; Old_des: D3; New_des: D2; UID: E29; Component Kind: Standard; ComponentLink1Description: Manufacturer URL; ComponentLink1URL: http://www.we-online.com; ComponentLink2Description: Datasheet; ComponentLink2URL: http://katalog.we-online.de/kataloge/eisos/media/pdf/82401646.pdf; PartNumber: 82401646; PackageReference: MSOP-8L
D3 = E29: TVS Diode WE-TVS-SS, VRWM=5V; Manufacturer: Wuerth Elektronik; Тип элемента: Сборка диодная; Reverse Stand Off Voltage: 5V; Old_des: D4; New_des: D3; UID: E29; Component Kind: Standard; ComponentLink1Description: Manufacturer URL; ComponentLink1URL: http://www.we-online.com; ComponentLink2Description: Datasheet; ComponentLink2URL: http://katalog.we-online.de/kataloge/eisos/media/pdf/82401646.pdf; PartNumber: 82401646; PackageReference: MSOP-8L
R1 = E98: Chip Resistor, 280 KOhm, +/- 1%, 100 mW, -55 to 155 degC, 0402 (1005 Metric), RoHS, Cut Tape; Manufacturer: Basic Passives; Тип элемента: Резистор; Case\/Package: 0402; Voltage Rating: 50 V; Power Rating: 100 mW; Old_des: R243; New_des: R1; UID: E98; Component Kind: Standard; Case Code (Imperial): 0402; Case Code (Metric): 1005; ComponentLink1Description: Manufacturer URL; ComponentLink1URL: http://www.panasonic.com/; ComponentLink2Description: Datasheet; ComponentLink2URL: http://industrial.panasonic.com/cdbs/www-data/pdf/RDA0000/AOA0000C86.pdf; DatasheetVersion: 04/2015; Length: 0.039 inch; Max Operating Temperature: 155 degC; Min Operating Temperature: -55 degC; Mounting Technology: Surface Mount; Package Quantity: 10000; PackageDescription: 2-Pin Surface Mount Device, Body 1 x 0.5 mm; Packaging: Cut Tape; PartNumber: ERJ-2RKF2803X; RoHSCompliant: true; Tolerance: 1%; Width: 0.02 inch; Height: 0.016 inch; Mount: Surface Mount; PackageReference: 0402; Pins: 2; REACH SVHC: Yes; Resistance: 280 KOhm
R2 = E58: Chip Resistor, 100 KOhm, +/- 1%, 100 mW, -55 to 155 degC, 0402 (1005 Metric), RoHS, Tape and Reel; Manufacturer: Basic Passives; Тип элемента: Резистор; Case\/Package: 0402; Voltage Rating: 50 V; Power Rating: 100 mW; Old_des: R242; New_des: R2; UID: E58; Component Kind: Standard; Case Code (Imperial): 0402; Case Code (Metric): 1005; ComponentLink1Description: Manufacturer URL; ComponentLink1URL: http://www.panasonic.com/; ComponentLink2Description: Datasheet; ComponentLink2URL: http://industrial.panasonic.com/cdbs/www-data/pdf/RDA0000/AOA0000C86.pdf; DatasheetVersion: 04/2015; Length: 1 mm; Max Operating Temperature: 155 degC; Min Operating Temperature: -55 degC; Mounting Technology: Surface Mount; Package Quantity: 10000; PackageDescription: 2-Pin Surface Mount Device, Body 1 x 0.5 mm; Packaging: Tape and Reel; PartNumber: ERJ-2RKF1003X; RoHSCompliant: true; Tolerance: 1%; Width: 0.5 mm; Height: 0.35 mm; Mount: Surface Mount; PackageReference: 0402; Pins: 2; Radiation Hardening: No; REACH SVHC: Yes; Resistance: 100 KOhm
R3 = E81: Chip Resistor, 1 MOhm, +/- 1%, 100 mW, -55 to 155 degC, 0402 (1005 Metric), RoHS, Tape and Reel; Manufacturer: Basic Passives; Тип элемента: Резистор; Case\/Package: 0402; Voltage Rating: 50 V; Power Rating: 100 mW; Resistance: 1 MOhm; Old_des: R246; New_des: R3; UID: E81; Component Kind: Standard; Case Code (Imperial): 0402; Case Code (Metric): 1005; ComponentLink1Description: Manufacturer URL; ComponentLink1URL: http://www.panasonic.com/; ComponentLink2Description: Datasheet; ComponentLink2URL: http://industrial.panasonic.com/cdbs/www-data/pdf/RDA0000/AOA0000C86.pdf; DatasheetVersion: 04/2015; Length: 1 mm; Max Operating Temperature: 155 degC; Min Operating Temperature: -55 degC; Mounting Technology: Surface Mount; Package Quantity: 10000; PackageDescription: 2-Pin Surface Mount Device, Body 1 x 0.5 mm; Packaging: Tape and Reel; PartNumber: ERJ-2RKF1004X; RoHSCompliant: true; Tolerance: 1%; Width: 0.5 mm; Height: 0.35 mm; Mount: Surface Mount; PackageReference: 0402; Pins: 2; Radiation Hardening: No; REACH SVHC: Yes; Weight: 2.8E-05oz
R4 = E81: Chip Resistor, 1 MOhm, +/- 1%, 100 mW, -55 to 155 degC, 0402 (1005 Metric), RoHS, Tape and Reel; Manufacturer: Basic Passives; Тип элемента: Резистор; Case\/Package: 0402; Voltage Rating: 50 V; Power Rating: 100 mW; Resistance: 1 MOhm; Old_des: R248; New_des: R5; UID: E81; Component Kind: Standard; Case Code (Imperial): 0402; Case Code (Metric): 1005; ComponentLink1Description: Manufacturer URL; ComponentLink1URL: http://www.panasonic.com/; ComponentLink2Description: Datasheet; ComponentLink2URL: http://industrial.panasonic.com/cdbs/www-data/pdf/RDA0000/AOA0000C86.pdf; DatasheetVersion: 04/2015; Length: 1 mm; Max Operating Temperature: 155 degC; Min Operating Temperature: -55 degC; Mounting Technology: Surface Mount; Package Quantity: 10000; PackageDescription: 2-Pin Surface Mount Device, Body 1 x 0.5 mm; Packaging: Tape and Reel; PartNumber: ERJ-2RKF1004X; RoHSCompliant: true; Tolerance: 1%; Width: 0.5 mm; Height: 0.35 mm; Mount: Surface Mount; PackageReference: 0402; Pins: 2; Radiation Hardening: No; REACH SVHC: Yes; Weight: 2.8E-05oz
R5 = E64: Chip Resistor, 0 mOhm, +/- 5%, 100 mW, -55 to 155 degC, 0402 (1005 Metric), RoHS, Tape and Reel; Manufacturer: Basic Passives; Тип элемента: Резистор; Case\/Package: 0402; Voltage Rating: 50 V; Power Rating: 100 mW; Resistance: 0 mOhm; Old_des: R245; New_des: R4; UID: E64; Component Kind: Standard; Case Code (Imperial): 0402; Case Code (Metric): 1005; ComponentLink1Description: Manufacturer URL; ComponentLink1URL: http://www.panasonic.com/; ComponentLink2Description: Datasheet; ComponentLink2URL: http://industrial.panasonic.com/cdbs/www-data/pdf/RDA0000/AOA0000C84.pdf; DatasheetVersion: 03/2015; Length: 1 mm; Max Operating Temperature: 155 degC; Min Operating Temperature: -55 degC; Mounting Technology: Surface Mount; Package Quantity: 10000; PackageDescription: 2-Pin Surface Mount Device, Body 1 x 0.5 mm; Packaging: Tape and Reel; PartNumber: ERJ-2GE0R00X; RoHSCompliant: true; Tolerance: 5%; Width: 0.5 mm; Height: 0.35 mm; Mount: Surface Mount; PackageReference: 0402; Pins: 2; Radiation Hardening: No; REACH SVHC: Unknown
R6 = E81: Chip Resistor, 1 MOhm, +/- 1%, 100 mW, -55 to 155 degC, 0402 (1005 Metric), RoHS, Tape and Reel; Manufacturer: Basic Passives; Тип элемента: Резистор; Case\/Package: 0402; Voltage Rating: 50 V; Power Rating: 100 mW; Resistance: 1 MOhm; Old_des: R247; New_des: R6; UID: E81; Component Kind: Standard; Case Code (Imperial): 0402; Case Code (Metric): 1005; ComponentLink1Description: Manufacturer URL; ComponentLink1URL: http://www.panasonic.com/; ComponentLink2Description: Datasheet; ComponentLink2URL: http://industrial.panasonic.com/cdbs/www-data/pdf/RDA0000/AOA0000C86.pdf; DatasheetVersion: 04/2015; Length: 1 mm; Max Operating Temperature: 155 degC; Min Operating Temperature: -55 degC; Mounting Technology: Surface Mount; Package Quantity: 10000; PackageDescription: 2-Pin Surface Mount Device, Body 1 x 0.5 mm; Packaging: Tape and Reel; PartNumber: ERJ-2RKF1004X; RoHSCompliant: true; Tolerance: 1%; Width: 0.5 mm; Height: 0.35 mm; Mount: Surface Mount; PackageReference: 0402; Pins: 2; Radiation Hardening: No; REACH SVHC: Yes; Weight: 2.8E-05oz
R7 = E58: Chip Resistor, 100 KOhm, +/- 1%, 100 mW, -55 to 155 degC, 0402 (1005 Metric), RoHS, Tape and Reel; Manufacturer: Basic Passives; Тип элемента: Резистор; Case\/Package: 0402; Voltage Rating: 50 V; Power Rating: 100 mW; Old_des: R244; New_des: R7; UID: E58; Component Kind: Standard; Case Code (Imperial): 0402; Case Code (Metric): 1005; ComponentLink1Description: Manufacturer URL; ComponentLink1URL: http://www.panasonic.com/; ComponentLink2Description: Datasheet; ComponentLink2URL: http://industrial.panasonic.com/cdbs/www-data/pdf/RDA0000/AOA0000C86.pdf; DatasheetVersion: 04/2015; Length: 1 mm; Max Operating Temperature: 155 degC; Min Operating Temperature: -55 degC; Mounting Technology: Surface Mount; Package Quantity: 10000; PackageDescription: 2-Pin Surface Mount Device, Body 1 x 0.5 mm; Packaging: Tape and Reel; PartNumber: ERJ-2RKF1003X; RoHSCompliant: true; Tolerance: 1%; Width: 0.5 mm; Height: 0.35 mm; Mount: Surface Mount; PackageReference: 0402; Pins: 2; Radiation Hardening: No; REACH SVHC: Yes; Resistance: 100 KOhm

## Sheet DisplayPort Connector.SchDoc
size 209 x 297 mm; Author: ALTIUM GOSTBOM2.0 KEV; SheetNumber: 4; SheetTotal: 48
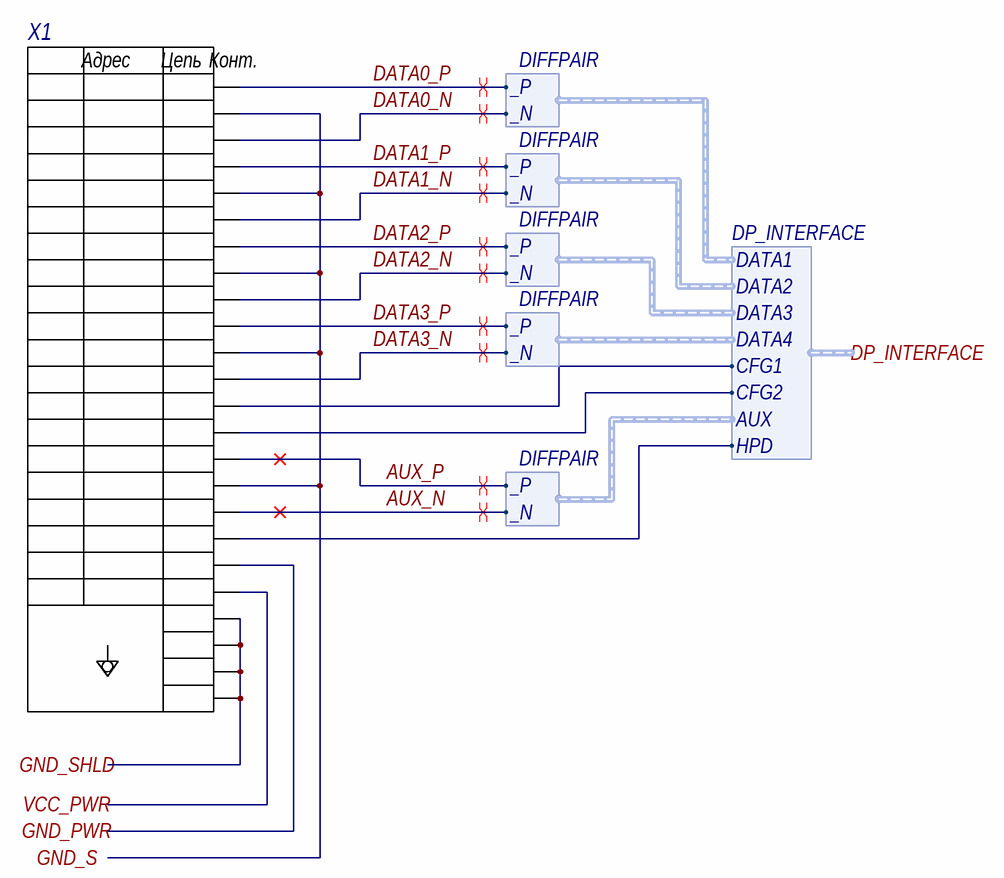
[diagram p30: DisplayPort Connector.SchDoc]

### Parts
X1  472720024  [MOLX-472720024_V]  (value not drawn)

### Ports
DP_INTERFACE (harness DP_INTERFACE), GND_PWR, GND_S, GND_SHLD, VCC_PWR

### Harnesses
DIFFPAIR: _P, _N
DP_INTERFACE: CFG1, DATA4, DATA3, DATA2, DATA1, CFG2, AUX, HPD

### Nets
GND: X1.2 X1.5 X1.8 X1.11 X1.16 ; port GND_S
AUX_N: X1.17 ; harness DIFFPAIR._N
AUX_P: X1.15 ; harness DIFFPAIR._P
DATA0_N: X1.3 ; harness DIFFPAIR._N  [project net DP_ML_LANE0_C_N]
DATA0_P: X1.1 ; harness DIFFPAIR._P  [project net DP_ML_LANE0_C_P]
DATA1_N: X1.6 ; harness DIFFPAIR._N  [project net DP_ML_LANE1_C_N]
DATA1_P: X1.4 ; harness DIFFPAIR._P  [project net DP_ML_LANE1_C_P]
DATA2_N: X1.9 ; harness DIFFPAIR._N  [project net DP_ML_LANE2_C_N]
DATA2_P: X1.7 ; harness DIFFPAIR._P  [project net DP_ML_LANE2_C_P]
DATA3_N: X1.12 ; harness DIFFPAIR._N  [project net DP_ML_LANE3_C_N]
DATA3_P: X1.10 ; harness DIFFPAIR._P  [project net DP_ML_LANE3_C_P]
DP_3V3: X1.20 ; port VCC_PWR
GND_DP: X1.21(SHLD1) X1.22(SHLD2) X1.23(SHLD3) X1.24(SHLD4) ; port GND_SHLD
NetR3_2: X1.13 ; port DP_INTERFACE.CFG1
NetR5_2: X1.19 ; port GND_PWR
NetR6_2: X1.14 ; port DP_INTERFACE.CFG2
NetR7_2: X1.18 ; port DP_INTERFACE.HPD

### Layout directives
differential pair: AUX_N, AUX_P, DP_ML_LANE0_C_N, DP_ML_LANE0_C_P, DP_ML_LANE1_C_N, DP_ML_LANE1_C_P, DP_ML_LANE2_C_N, DP_ML_LANE2_C_P, DP_ML_LANE3_C_N, DP_ML_LANE3_C_P

### Notes on the sheet
- Подп. дата
- Инв. № дубл.
- Взам. инв. №
- Подп. и дата
- Инв. № подл.
- Изм.
- Лист
- № докум.
- Подп.
- Дата
- Файл:
- ALTIUM GOSTBOM2.0 KEV
- Копировал
- Формат А4
- (in symbol E34) Адрес; Цепь; Конт.

### Library data of the parts
X1 = E34: DisplayPort Connector, Pitch 0.5 mm, 1 x 20 Position, Height 6.65 mm, -20 to 85 degC, RoHS, Tape and Reel; Manufacturer: Molex; Тип элемента: Соединитель; Old_des: J6; New_des: X1; UID: E34; Component Kind: Standard; ComponentLink1Description: Manufacturer URL; ComponentLink1URL: http://www.molex.com/; ComponentLink2Description: Datasheet; ComponentLink2URL: http://www.molex.com/pdm_docs/sd/472720024_sd.pdf; DatasheetVersion: Rev. F; Mounting Technology: Surface Mount; PackageDescription: DisplayPort Connector, Pitch 0.5 mm, 1 x 20 Position, Height 6.65 mm; PartNumber: 472720024; PackageReference: 472720024; ClassName: A1

## Sheet SFP Connectors.SchDoc
size 209 x 297 mm; Author: ALTIUM GOSTBOM2.0 KEV; SheetNumber: 30; SheetTotal: 48
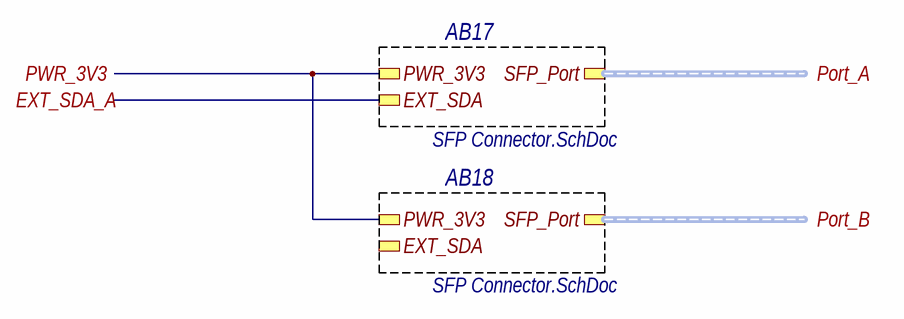
[diagram p31: SFP Connectors.SchDoc]

### Sub-sheets
AB17 = SFP Connector.SchDoc: SFP_Port (harness SFP), PWR_3V3, EXT_SDA
AB18 = SFP Connector.SchDoc: SFP_Port (harness SFP), PWR_3V3, EXT_SDA

### Ports
EXT_SDA_A, Port_A (harness SFP), Port_B (harness SFP), PWR_3V3

### Nets
EXT_SDA: port EXT_SDA_A, sheet AB17/EXT_SDA
IO_3V3: port PWR_3V3, sheet AB17/PWR_3V3, sheet AB18/PWR_3V3

### Buses and harness runs
harness port Port_A = sheet AB17/SFP_Port
harness port Port_B = sheet AB18/SFP_Port

### Notes on the sheet
- Подп. дата
- Инв. № дубл.
- Взам. инв. №
- Подп. и дата
- Инв. № подл.
- Изм.
- Лист
- № докум.
- Подп.
- Дата
- Файл:
- ALTIUM GOSTBOM2.0 KEV
- Копировал
- Формат А4